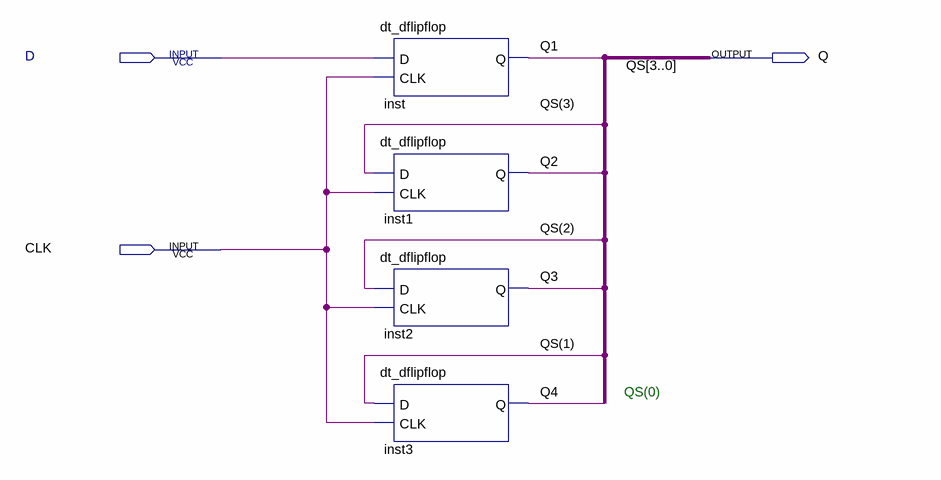
[diagram p0: schematic sheet]
// Quartus schematic aufgabe_symbol3.bdf as structural Verilog: 4 symbols, 3 pins
module aufgabe_symbol3 (
  input  D,
  input  CLK,
  output Q
);

  wire Q1, Q2, Q3, Q4, \QS(1) , \QS(2) , \QS(3) ;

  dt_dflipflop inst (.D(D), .CLK(CLK), .Q(Q1));
  dt_dflipflop inst1 (.D(\QS(3) ), .CLK(CLK), .Q(Q2));
  dt_dflipflop inst2 (.D(\QS(2) ), .CLK(CLK), .Q(Q3));
  dt_dflipflop inst3 (.D(\QS(1) ), .CLK(CLK), .Q(Q4));

  // Notes on the sheet:
  //   QS(0)
endmodule
